# Altium schematic sheet BANK34_35.SchDoc
size A4; SheetNumber: 4; SheetTotal: 13
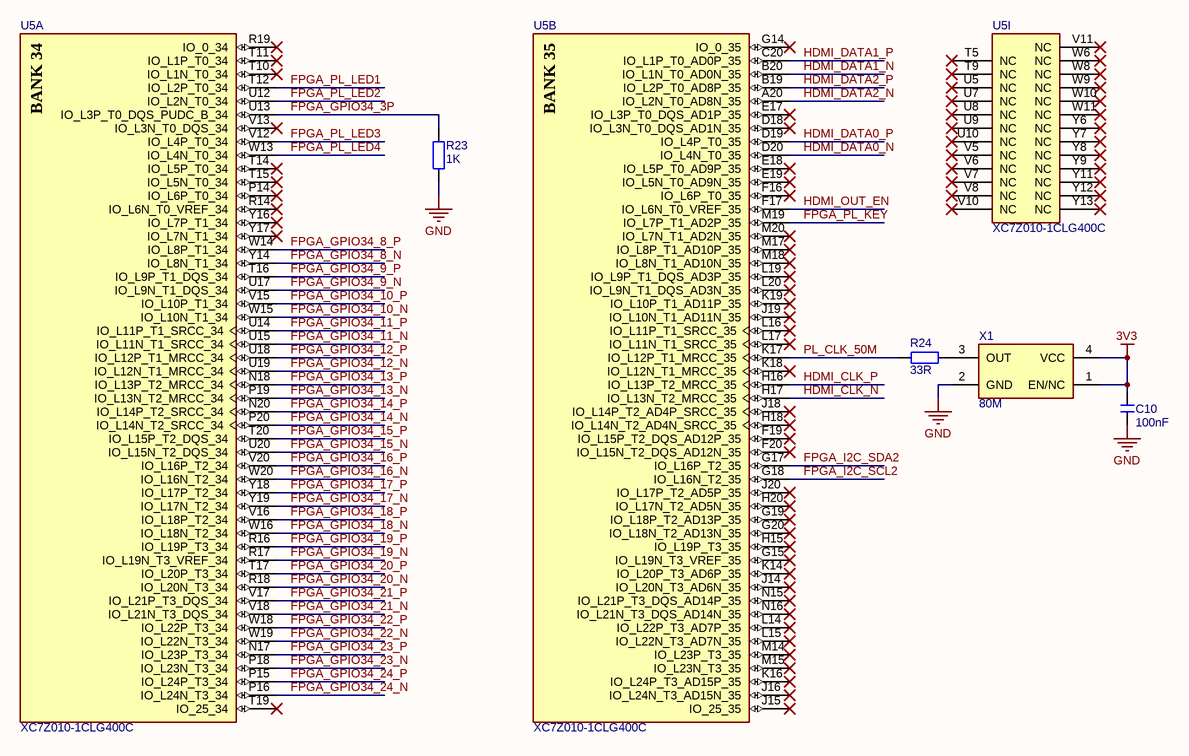
[diagram p0: BANK34_35.SchDoc]

## Parts
C10  100nF  [C 0402_L]
R23  1K  [R 0402_L]
R24  33R  [R 0805_L]
U5  XC7Z010-1CLG400C  [CLG400]  (parts A,B,I of 9)
X1  80M  [OSC 1612-4P]

## Nets
3V3: C10.2 X1.1(EN/NC) X1.4(VCC)
GND: C10.1 R23.2 X1.2(GND)
FPGA_GPIO34_3P: R23.1 U5.U13(IO_L3P_T0_DQS_PUDC_B_34)
FPGA_GPIO34_8_N: U5.Y14(IO_L8N_T1_34)
FPGA_GPIO34_8_P: U5.W14(IO_L8P_T1_34)
FPGA_GPIO34_9_N: U5.U17(IO_L9N_T1_DQS_34)
FPGA_GPIO34_9_P: U5.T16(IO_L9P_T1_DQS_34)
FPGA_GPIO34_10_N: U5.W15(IO_L10N_T1_34)
FPGA_GPIO34_10_P: U5.V15(IO_L10P_T1_34)
FPGA_GPIO34_11_N: U5.U15(IO_L11N_T1_SRCC_34)
FPGA_GPIO34_11_P: U5.U14(IO_L11P_T1_SRCC_34)
FPGA_GPIO34_12_N: U5.U19(IO_L12N_T1_MRCC_34)
FPGA_GPIO34_12_P: U5.U18(IO_L12P_T1_MRCC_34)
FPGA_GPIO34_13_N: U5.P19(IO_L13N_T2_MRCC_34)
FPGA_GPIO34_13_P: U5.N18(IO_L13P_T2_MRCC_34)
FPGA_GPIO34_14_N: U5.P20(IO_L14N_T2_SRCC_34)
FPGA_GPIO34_14_P: U5.N20(IO_L14P_T2_SRCC_34)
FPGA_GPIO34_15_N: U5.U20(IO_L15N_T2_DQS_34)
FPGA_GPIO34_15_P: U5.T20(IO_L15P_T2_DQS_34)
FPGA_GPIO34_16_N: U5.W20(IO_L16N_T2_34)
FPGA_GPIO34_16_P: U5.V20(IO_L16P_T2_34)
FPGA_GPIO34_17_N: U5.Y19(IO_L17N_T2_34)
FPGA_GPIO34_17_P: U5.Y18(IO_L17P_T2_34)
FPGA_GPIO34_18_N: U5.W16(IO_L18N_T2_34)
FPGA_GPIO34_18_P: U5.V16(IO_L18P_T2_34)
FPGA_GPIO34_19_N: U5.R17(IO_L19N_T3_VREF_34)
FPGA_GPIO34_19_P: U5.R16(IO_L19P_T3_34)
FPGA_GPIO34_20_N: U5.R18(IO_L20N_T3_34)
FPGA_GPIO34_20_P: U5.T17(IO_L20P_T3_34)
FPGA_GPIO34_21_N: U5.V18(IO_L21N_T3_DQS_34)
FPGA_GPIO34_21_P: U5.V17(IO_L21P_T3_DQS_34)
FPGA_GPIO34_22_N: U5.W19(IO_L22N_T3_34)
FPGA_GPIO34_22_P: U5.W18(IO_L22P_T3_34)
FPGA_GPIO34_23_N: U5.P18(IO_L23N_T3_34)
FPGA_GPIO34_23_P: U5.N17(IO_L23P_T3_34)
FPGA_GPIO34_24_N: U5.P16(IO_L24N_T3_34)
FPGA_GPIO34_24_P: U5.P15(IO_L24P_T3_34)
FPGA_I2C_SCL2: U5.G18(IO_L16N_T2_35)
FPGA_I2C_SDA2: U5.G17(IO_L16P_T2_35)
FPGA_PL_KEY: U5.M19(IO_L7P_T1_AD2P_35)
FPGA_PL_LED1: U5.T12(IO_L2P_T0_34)
FPGA_PL_LED2: U5.U12(IO_L2N_T0_34)
FPGA_PL_LED3: U5.V12(IO_L4P_T0_34)
FPGA_PL_LED4: U5.W13(IO_L4N_T0_34)
HDMI_CLK_N: U5.H17(IO_L13N_T2_MRCC_35)
HDMI_CLK_P: U5.H16(IO_L13P_T2_MRCC_35)
HDMI_DATA0_N: U5.D20(IO_L4N_T0_35)
HDMI_DATA0_P: U5.D19(IO_L4P_T0_35)
HDMI_DATA1_N: U5.B20(IO_L1N_T0_AD0N_35)
HDMI_DATA1_P: U5.C20(IO_L1P_T0_AD0P_35)
HDMI_DATA2_N: U5.A20(IO_L2N_T0_AD8N_35)
HDMI_DATA2_P: U5.B19(IO_L2P_T0_AD8P_35)
HDMI_OUT_EN: U5.F17(IO_L6N_T0_VREF_35)
PL_CLK_50M: R24.2 U5.K17(IO_L12P_T1_MRCC_35)
NetR24_1: R24.1 X1.3(OUT)

Not connected (* = marked no-connect by the designer): U5 D18(IO_L3N_T0_DQS_AD1N_35)* E17(IO_L3P_T0_DQS_AD1P_35)* E18(IO_L5P_T0_AD9P_35)* E19(IO_L5N_T0_AD9N_35)* F16(IO_L6P_T0_35)* F19(IO_L15P_T2_DQS_AD12P_35)* F20(IO_L15N_T2_DQS_AD12N_35)* G14(IO_0_35)* G15(IO_L19N_T3_VREF_35)* G19(IO_L18P_T2_AD13P_35)* G20(IO_L18N_T2_AD13N_35)* H15(IO_L19P_T3_35)* H18(IO_L14N_T2_AD4N_SRCC_35)* H20(IO_L17N_T2_AD5N_35)* J14(IO_L20N_T3_AD6N_35)* J15(IO_25_35)* J16(IO_L24N_T3_AD15N_35)* J18(IO_L14P_T2_AD4P_SRCC_35)* J19(IO_L10N_T1_AD11N_35)* J20(IO_L17P_T2_AD5P_35)* K14(IO_L20P_T3_AD6P_35)* K16(IO_L24P_T3_AD15P_35)* K18(IO_L12N_T1_MRCC_35)* K19(IO_L10P_T1_AD11P_35)* L14(IO_L22P_T3_AD7P_35)* L15(IO_L22N_T3_AD7N_35)* L16(IO_L11P_T1_SRCC_35)* L17(IO_L11N_T1_SRCC_35)* L19(IO_L9P_T1_DQS_AD3P_35)* L20(IO_L9N_T1_DQS_AD3N_35)* M14(IO_L23P_T3_35)* M15(IO_L23N_T3_35)* M17(IO_L8P_T1_AD10P_35)* M18(IO_L8N_T1_AD10N_35)* M20(IO_L7N_T1_AD2N_35)* N15(IO_L21P_T3_DQS_AD14P_35)* N16(IO_L21N_T3_DQS_AD14N_35)* P14(IO_L6P_T0_34)* R14(IO_L6N_T0_VREF_34)* R19(IO_0_34)* T5(NC)* T9(NC)* T10(IO_L1N_T0_34)* T11(IO_L1P_T0_34)* T14(IO_L5P_T0_34)* T15(IO_L5N_T0_34)* T19(IO_25_34)* U5(NC)* U7(NC)* U8(NC)* U9(NC)* U10(NC)* V5(NC)* V6(NC)* V7(NC)* V8(NC)* V10(NC)* V11(NC)* V13(IO_L3N_T0_DQS_34)* W6(NC)* W8(NC)* W9(NC)* W10(NC)* W11(NC)* Y6(NC)* Y7(NC)* Y8(NC)* Y9(NC)* Y11(NC)* Y12(NC)* Y13(NC)* Y16(IO_L7P_T1_34)* Y17(IO_L7N_T1_34)*

## Notes on the sheet
- (in symbol XC7Z010-1CLG400C, part A) BANK 34
- (in symbol XC7Z010-1CLG400C, part B) BANK 35

## Library data of the parts
C10 = C: 无极性贴片电容; 版权归属: 源创客; BOM名称: 无极性贴片电容; 学习资源: www.ooocke.com
R23 R24 = R: 贴片电阻; 版权归属: 源创客; BOM名称: 贴片电阻; 学习资源: www.ooocke.com
U5 = XC7Z010-1CLG400C: ZYNQ7000芯片
X1 = XTAL-ACT-4P: 4脚有源晶振; 版权归属: 源创客; BOM名称: 4脚有源晶振; 学习资源: www.ooocke.com